# Altium schematic sheet main_hall.SchDoc
size 420 x 297 mm; Address1: Address1; Address2: Address2; Address3: Address3; Address4: Address4; SheetNumber: 1; Scale: 1:1; Разраб.: Иванов; Обозначение документа: АБВГ.123456.001 Э3; Пров.: Петров; Утв.: Сидоров; Наименование организации: ОАО "Концерн "МПО-Гидроприбор"; Перв. применение: АБВГ.123456.000; Наименование изделия 1: Плата; Наименование изделия 2: Схема электрическая; Наименование изделия 3: принципиальная; Нач. отд.: Нач. отд.; Фамилия нач. отд.: Сидоров
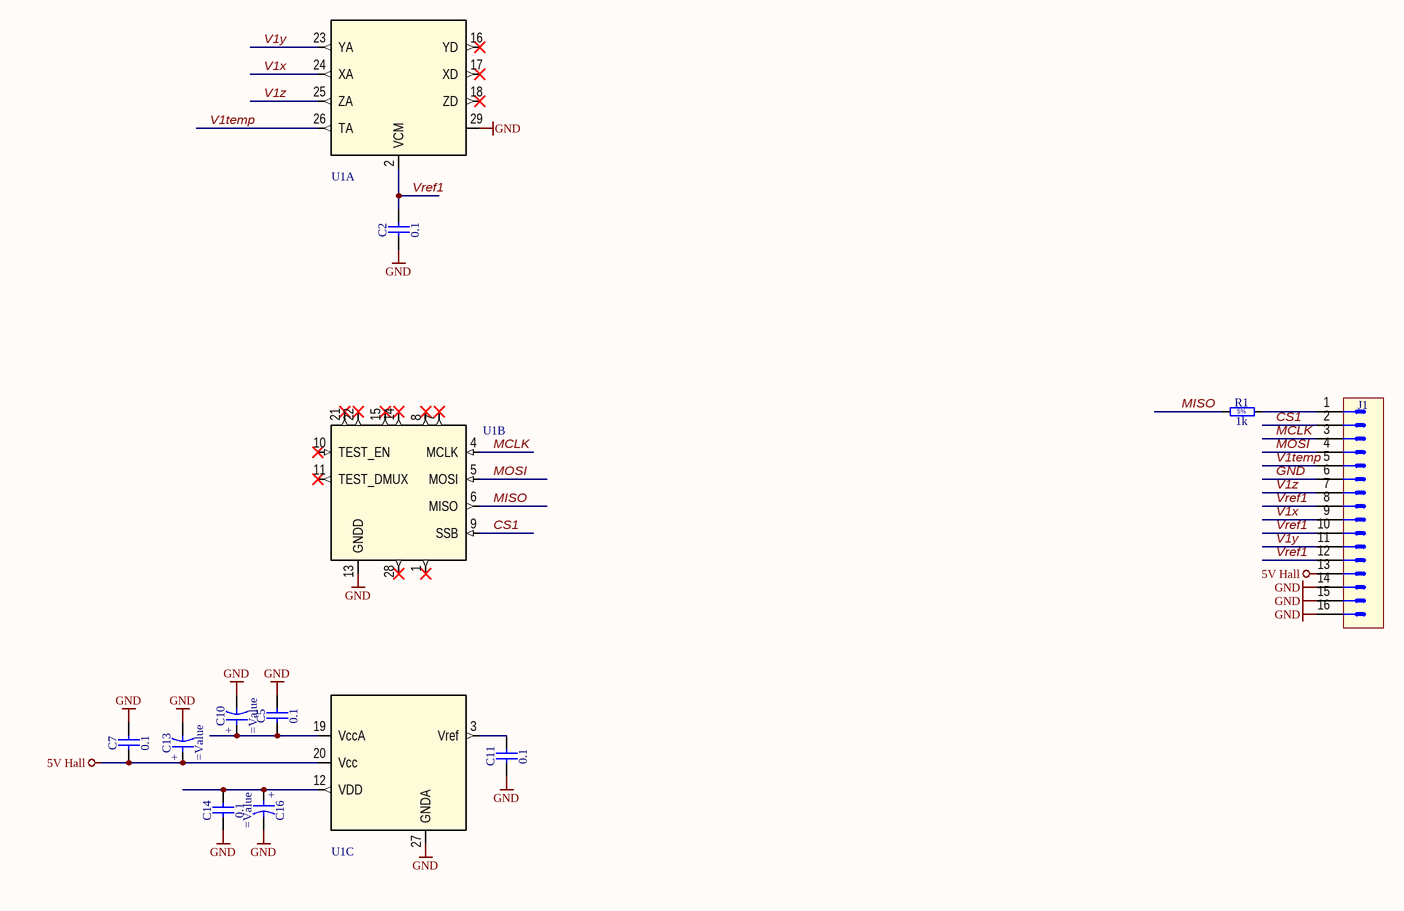
[diagram p0: main_hall.SchDoc]

## Parts
C2  0.1  [CAPC3216X100N]
C5  0.1  [CAPC3216X100N]
C7  0.1  [CAPC3216X100N]
C10  (no value)  [CAPMP3528X120N]
C11  0.1  [CAPC3216X100N]
C13  (no value)  [CAPMP3528X120N]
C14  0.1  [CAPC3216X100N]
C16  (no value)  [CAPMP3528X120N]
J1  (no value)  [3M_N2516-5002RB]
R1  1k  [RESC2012X70N]
U1  Hall sensor  [QFN50P500X500X100-29N-S325]  (value not drawn)  (parts A,B,C of 3)

## Nets
5V Hall: C7.1 C13.1 J1.13 U1.20(Vcc)
GND: C2.1 C5.2 C7.2 C10.2 C11.1 C13.2 C14.1 C16.2 J1.6 J1.14 J1.15 J1.16 U1.13(GNDD) U1.27(GNDA) U1.29
CS1: J1.2 U1.9(SSB)
MCLK: J1.3 U1.4(MCLK)
MISO: R1.1 U1.6(MISO)
MOSI: J1.4 U1.5(MOSI)
V1temp: J1.5 U1.26(TA)
V1x: J1.9 U1.24(XA)
V1y: J1.11 U1.23(YA)
V1z: J1.7 U1.25(ZA)
Vref1: C2.2 J1.8 J1.10 J1.12 U1.2(VCM)
NetC5_1: C5.1 C10.1 U1.19(VccA)
NetC11_2: C11.2 U1.3(Vref)
NetC14_2: C14.2 C16.1 U1.12(VDD)
NetJ1_1: J1.1 R1.2

Not connected (* = marked no-connect by the designer): U1 1* 7* 8* 10(TEST_EN)* 11(TEST_DMUX)* 14* 15* 16(YD)* 17(XD)* 18(ZD)* 21* 22* 28*

## Notes on the sheet
- Перв. примен.
- Справ. №
- Подп. и дата
- Инв. № дубл.
- Взам. инв. №
- Разраб.
- Изм.
- Лист
- № докум.
- Подп.
- Дата
- Лит.
- Масса
- Масштаб
- Пров.
- Т.контр.
- Листов
- Инв. № подл.
- Утв.
- Н.контр.
- Копировал
- Формат А3
- (in symbol Capacitor - polarized) +

## Library data of the parts
C2 C5 C7 C11 C14 = Capacitor1206 - non polarized: Non-polarised1206 capacitor; SolderOption: 0; SMD Solders: 2; Dielectric type: X5R; Vendor: any; Value: 0.1; THD Solders: 0
C10 C13 C16 = Capacitor - polarized: Polarised capacitor; SMD Solders: 2; SolderOption: 0; Parameter 2: *; THD Solders: 0; Vendor: *
J1 = Connector 16: Solder Option: 0; THD Solders: 16; SMD Solders: 0; Vendor: *; Value: *
R1 = Resistor - 5%: Vendor: any; SMD Solders: 2; THD Solders: 0; TK: 1000ppmC^(-1); Value: 1k; SolderOption: 0; Tolerance: 5%
U1 = Hall sensor: SENM3Dx Vertical Hall Sensor